# Altium schematic sheet DS3231.SchDoc
size A4; SheetNumber: 10; SheetTotal: 10
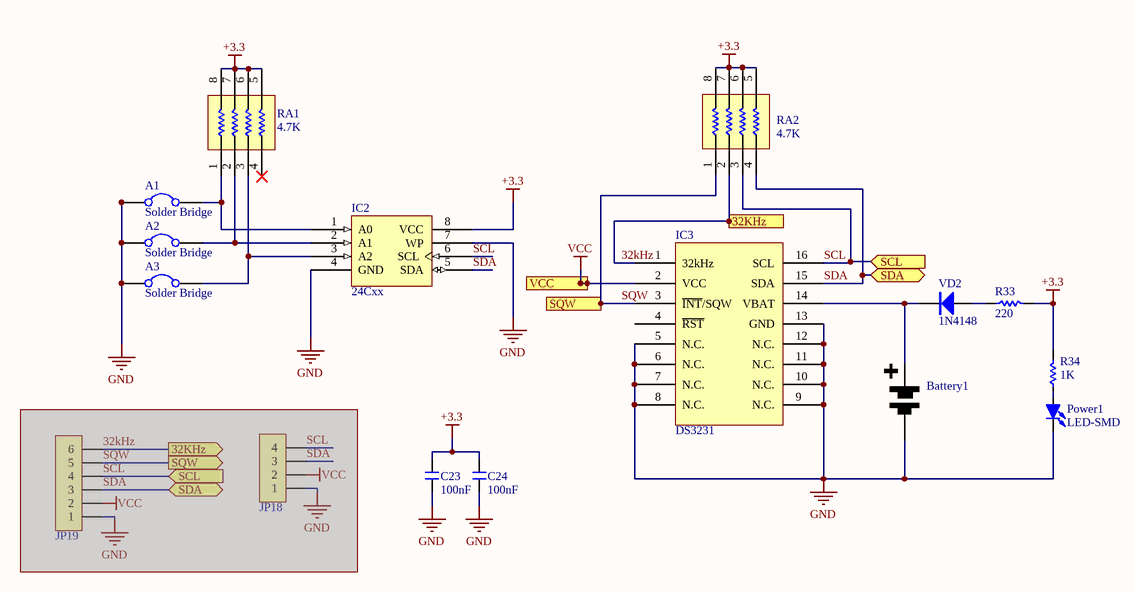
[diagram p0: DS3231.SchDoc]

## Parts
A1  Solder Bridge  [Solder Bridge]
A2  Solder Bridge  [Solder Bridge]
A3  Solder Bridge  [Solder Bridge]
Battery1  Battery Button Cell  [CR2032]  (value not drawn)
C23  100nF  [C 0805]
C24  100nF  [C 0805]
IC2  24Cxx  [SOP8_L]
IC3  DS3231  [SOP16W_L]
JP18  HDR-1X4  [HDR-1X4]  (value not drawn)  (masked out: inside a compile mask, not in the netlist)
JP19  HDR-1X6  [HDR-1X6]  (value not drawn)  (masked out: inside a compile mask, not in the netlist)
Power1  LED-SMD  [LED 0805R]
R33  220  [R 0805]
R34  1K  [R 0805]
RA1  4.7K  [RA1206 (4x0603)]
RA2  4.7K  [RA1206 (4x0603)]
VD2  1N4148  [MINI_MELF (LL34)]

## Ports
32KHz (out), SCL (in), SDA (bidir), SQW (out), VCC

## Nets
+3.3: C23.1 C24.2 IC2.8(VCC) R33.2 R34.2 RA1.5 RA1.6 RA1.7 RA1.8 RA2.5 RA2.6 RA2.7 RA2.8
GND: A1.1 A2.1 A3.1 Battery1.2(-) C23.2 C24.1 IC2.4(GND) IC2.7(WP) IC3.5(N.C.) IC3.6(N.C.) IC3.7(N.C.) IC3.8(N.C.) IC3.9(N.C.) IC3.10(N.C.) IC3.11(N.C.) IC3.12(N.C.) IC3.13(GND) Power1.2(K)
VCC: IC3.2(VCC) ; port VCC
32kHz: IC3.1(32kHz) RA2.2 ; port 32KHz
SCL: IC2.6(SCL) IC3.16(SCL) RA2.3 ; port SCL
SDA: IC2.5(SDA) IC3.15(SDA) RA2.4 ; port SDA
SQW: IC3.3(~{INT}/SQW) RA2.1 ; port SQW
NetA1_2: A1.2 IC2.1(A0) RA1.1
NetA2_2: A2.2 IC2.2(A1) RA1.2
NetA3_2: A3.2 IC2.3(A2) RA1.3
NetBattery1_1: Battery1.1(+) IC3.14(VBAT) VD2.2(K)
NetPower1_1: Power1.1(A) R34.1
NetR33_1: R33.1 VD2.1(A)

Not connected (* = marked no-connect by the designer): IC3 4(~{RST}); RA1 4*

## Library data of the parts
Battery1 = Battery Button Cell: Mini Battery
C23 C24 = C: Non-polar patch capacitor; BOM名称: 无极性贴片电容; 版权归属: 源创客; 学习资源: www.ooocke.com
IC2 = 24Cxx: Two-wire Serial EEPROM; BOM名称: 外置EEPROM; 版权归属: 源创客; 学习资源: www.ooocke.com
IC3 = DS3231: Real time clock chip
JP18 = Header 4: 4P connector; BOM名称: 4P接插件; 版权归属: 源创客; 学习资源: www.ooocke.com
JP19 = Header 6: 6P接插件; 版权归属: 源创客; BOM名称: 6P接插件; 学习资源: www.ooocke.com
Power1 = LED-SMD: Patch LED; BOM名称: 贴片LED; 版权归属: 源创客; 学习资源: www.ooocke.com
R33 R34 = R: Chip resistor; 版权归属: 源创客; BOM名称: Chip resistor; 学习资源: www.ooocke.com
RA1 RA2 = R-ARR: 4 way Chip Resistor Array
VD2 = 1N4148: High speed switching diode; BOM名称: 高速开关二极管; 版权归属: 源创客; 学习资源: www.ooocke.com